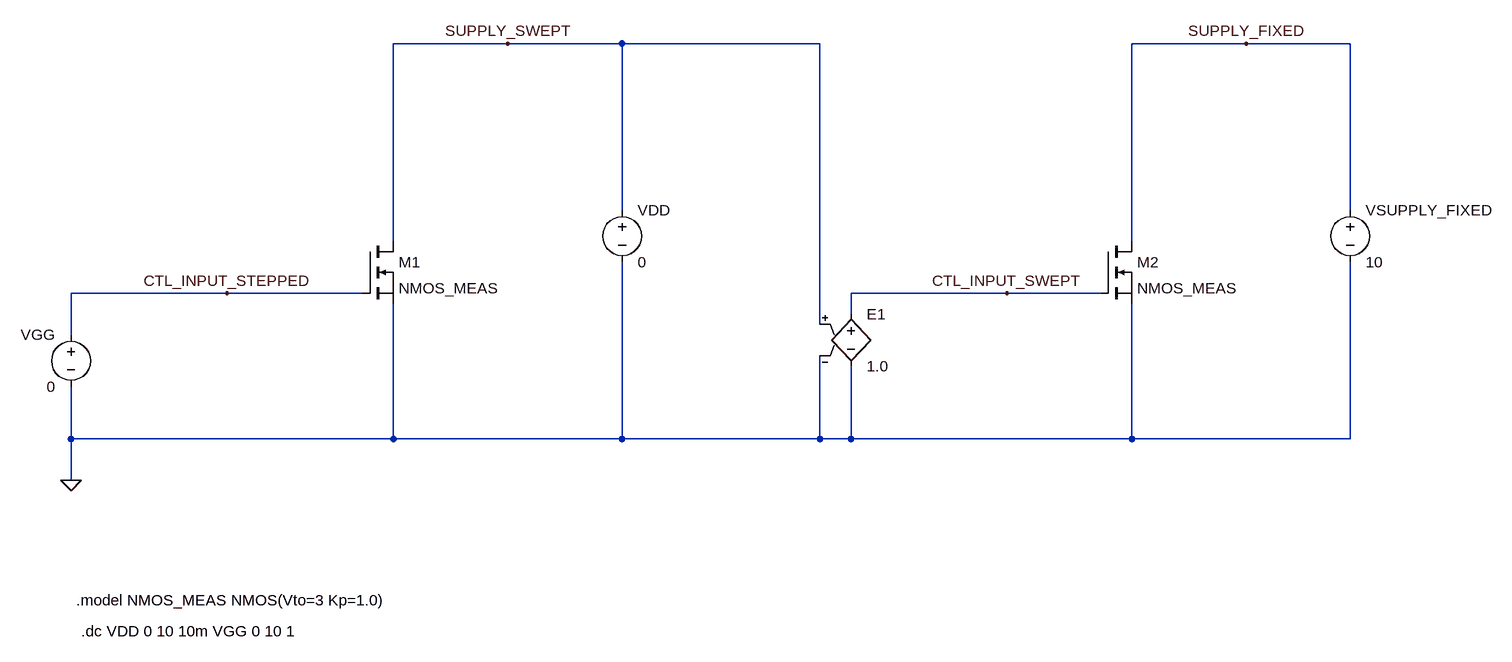
[diagram p0: schematic Common_Source_Common_Emitter_Test_Bench.asc]
Common_Source_Common_Emitter_Test_Bench.asc, the LTspice schematic file:
Version 4.1
SHEET 1 1900 1700
WIRE 384 -144 208 -144
WIRE 560 -144 384 -144
WIRE 864 -144 560 -144
WIRE 1520 -144 1344 -144
WIRE 1680 -144 1520 -144
WIRE 560 112 560 -144
WIRE 1680 112 1680 -144
WIRE 208 160 208 -144
WIRE 1344 160 1344 -144
WIRE -48 240 -288 240
WIRE 160 240 -48 240
WIRE 1152 240 912 240
WIRE 1296 240 1152 240
WIRE 912 272 912 240
WIRE 864 288 864 -144
WIRE -288 304 -288 240
WIRE -288 464 -288 384
WIRE 208 464 208 256
WIRE 208 464 -288 464
WIRE 560 464 560 192
WIRE 560 464 208 464
WIRE 864 464 864 336
WIRE 864 464 560 464
WIRE 912 464 912 352
WIRE 912 464 864 464
WIRE 1344 464 1344 256
WIRE 1344 464 912 464
WIRE 1680 464 1680 192
WIRE 1680 464 1344 464
WIRE -288 528 -288 464
FLAG -288 528 0
FLAG 1152 240 CTL_INPUT_SWEPT
FLAG -48 240 CTL_INPUT_STEPPED
FLAG 384 -144 SUPPLY_SWEPT
FLAG 1520 -144 SUPPLY_FIXED
SYMBOL nmos 160 160 R0
SYMATTR InstName M1
SYMATTR Value NMOS_MEAS
SYMBOL voltage -288 288 M0
WINDOW 123 0 0 Left 0
WINDOW 39 0 0 Left 0
SYMATTR InstName VGG
SYMATTR Value 0
SYMBOL voltage 560 96 R0
WINDOW 123 0 0 Left 0
WINDOW 39 0 0 Left 0
SYMATTR InstName VDD
SYMATTR Value 0
SYMBOL e 912 256 R0
SYMATTR InstName E1
SYMATTR Value 1.0
SYMBOL nmos 1296 160 R0
SYMATTR InstName M2
SYMATTR Value NMOS_MEAS
SYMBOL voltage 1680 96 R0
WINDOW 123 0 0 Left 0
WINDOW 39 0 0 Left 0
SYMATTR InstName VSUPPLY_FIXED
SYMATTR Value 10
TEXT -280 712 Left 2 !.model NMOS_MEAS NMOS(Vto=3 Kp=1.0)
TEXT -272 760 Left 2 !.dc VDD 0 10 10m VGG 0 10 1

The netlist it stands for:
* Common_Source_Common_Emitter_Test_Bench.asc
M1 SUPPLY_SWEPT CTL_INPUT_STEPPED 0 0 NMOS_MEAS
VGG CTL_INPUT_STEPPED 0 0
VDD SUPPLY_SWEPT 0 0
E1 CTL_INPUT_SWEPT 0 SUPPLY_SWEPT 0 1.0
M2 SUPPLY_FIXED CTL_INPUT_SWEPT 0 0 NMOS_MEAS
VSUPPLY_FIXED SUPPLY_FIXED 0 10
.model NMOS NMOS
.model PMOS PMOS
.lib standard.mos
.model NMOS_MEAS NMOS(Vto=3 Kp=1.0)
.dc VDD 0 10 10m VGG 0 10 1
.backanno
.end